# EAGLE design gpioextender (EAGLE 9.6.2)
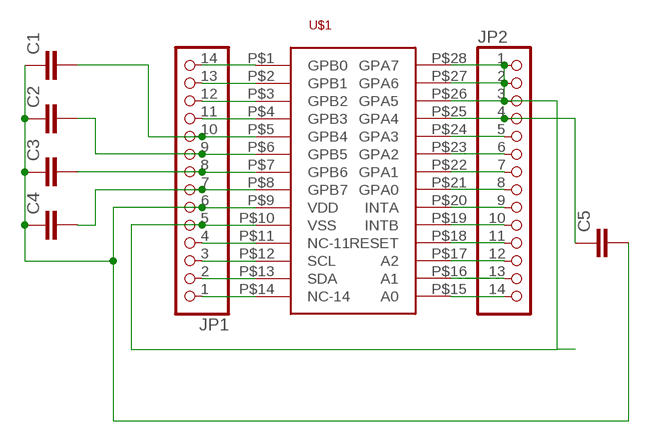
[diagram p0: schematic, sheet 1]

## Parts
C1  C-EU050-025X075  [C050-025X075]
C2  C-EU050-025X075  [C050-025X075]
C3  C-EU050-025X075  [C050-025X075]
C4  C-EU050-025X075  [C050-025X075]
C5  C-EU050-025X075  [C050-025X075]
JP1  PINHD-1X14  [1X14]
JP2  PINHD-1X14  [1X14]
U$1  MCP23017-E/SP  [DIP28]

## Nets
N$1: C1.2 C4.2 JP1.7 JP1.10 U$1.P$5(GPB4) U$1.P$8(GPB7)
N$2: JP1.1 U$1.P$14(NC-14)
N$3: JP1.2 U$1.P$13(SDA)
N$4: JP1.3 U$1.P$12(SCL)
N$5: JP1.4 U$1.P$11(NC-11)
N$6: JP2.12 U$1.P$17(A2)
N$7: JP2.13 U$1.P$16(A1)
N$8: C3.2 JP1.8 U$1.P$7(GPB6)
N$9: C2.2 JP1.9 U$1.P$6(GPB5)
N$10: JP1.11 U$1.P$4(GPB3)
N$11: JP1.12 U$1.P$3(GPB2)
N$12: JP1.13 U$1.P$2(GPB1)
N$13: JP1.14 U$1.P$1(GPB0)
N$14: JP2.14 U$1.P$15(A0)
N$15: C1.1 C2.1 C3.1 C4.1 C5.2 JP1.6 U$1.P$9(VDD)
N$16: JP1.5 JP2.1 JP2.2 JP2.3 U$1.P$10(VSS) U$1.P$26(GPA5) U$1.P$27(GPA6) U$1.P$28(GPA7)
N$17: JP2.11 U$1.P$18(RESET)
N$18: JP2.10 U$1.P$19(INTB)
N$19: JP2.9 U$1.P$20(INTA)
N$20: JP2.8 U$1.P$21(GPA0)
N$21: JP2.7 U$1.P$22(GPA1)
N$22: JP2.6 U$1.P$23(GPA2)
N$23: JP2.5 U$1.P$24(GPA3)
N$24: C5.1 JP2.4 U$1.P$25(GPA4)

## Library data of the parts
C1-C5 = resistor:C-EU: CAPACITOR, European symbol
JP1 JP2 = pinhead:PINHD-1X14: PIN HEADER
U$1 = IO-Expanders:MCP23017-E/SP: MCP23017 16 pin IO Expander using I2C bus; MCP23017-ESP: DIP

## Board
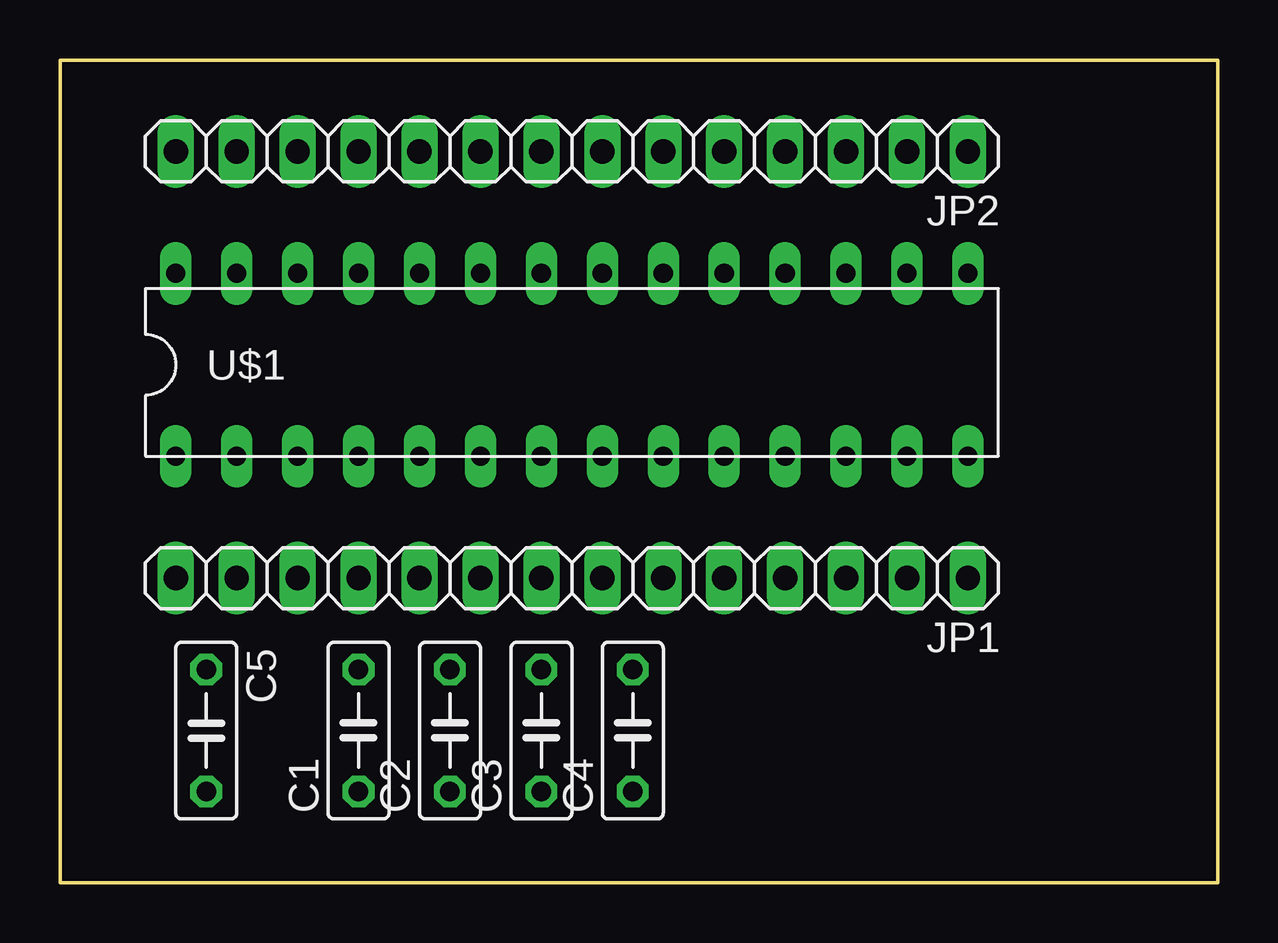
[diagram p1: board, top side]
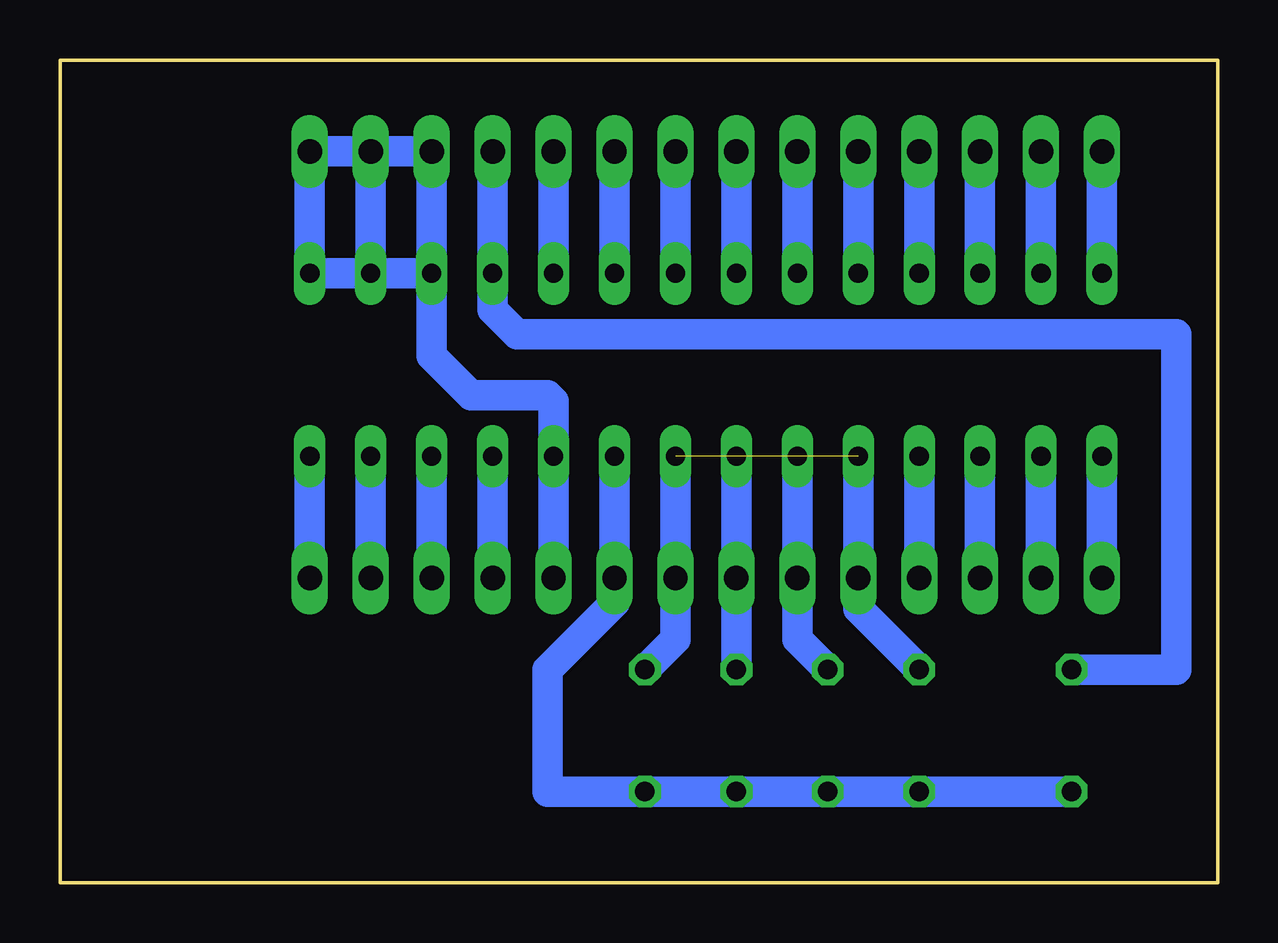
[diagram p2: board, bottom side, seen from below]

Size 48.26 x 34.29 mm. Coordinates in mm from the lower left corner, seen from the top.
Outline: 0,0 48.26,0 48.26,34.29 0,34.29 0,0
Copper layers (1*16): Top 0.035mm / dielectric 1.5mm / Bottom 0.035mm
Design rules "default": minimum track width 6mil, minimum drill 0.35mm, track to track 6mil, track to pad 6mil, pad to pad 6mil, via to via 6mil, smd to smd 6mil, copper to edge 40mil, drill to drill 6mil, minimum pad ring 10mil, minimum via ring 8mil, stop-mask expansion 4mil, vias tented up to drill 0mil, thermal gap 10mil

### Footprints (pad centres in the part's own frame; a part is rotated, then mirrored left to right if it is on the bottom)
C050-025X075 = drill 0.813 octagon: 1 -2.54,0; 2 2.54,0
1X14 = drill 1.016 long: 1 -16.51,0; 2 -13.97,0; 3 -11.43,0; 4 -8.89,0; 5 -6.35,0; 6 -3.81,0; 7 -1.27,0; 8 1.27,0; 9 3.81,0; 10 6.35,0; 11 8.89,0; 12 11.43,0; 13 13.97,0; 14 16.51,0
DIP28 = drill 0.8 long: P$1 0,0; P$2 2.54,0; P$3 5.08,0; P$4 7.62,0; P$5 10.16,0; P$6 12.7,0; P$7 15.24,0; P$8 17.78,0; P$9 20.32,0; P$10 22.86,0; P$11 25.4,0; P$12 27.94,0; P$13 30.48,0; P$14 33.02,0; P$15 0,7.62; P$16 2.54,7.62; P$17 5.08,7.62; P$18 7.62,7.62; P$19 10.16,7.62; P$20 12.7,7.62; P$21 15.24,7.62; P$22 17.78,7.62; P$23 20.32,7.62; P$24 22.86,7.62; P$25 25.4,7.62; P$26 27.94,7.62; P$27 30.48,7.62; P$28 33.02,7.62

### Placement (x,y rotation side)
C1  12.45,6.35 90 top
C2  16.26,6.35 90 top
C3  20.07,6.35 90 top
C4  23.88,6.35 90 top
C5  6.1,6.35 270 top
JP1  21.34,12.7 180 top
JP2  21.34,30.48 180 top
U$1  4.83,17.78 0 top

### Tracks (layer width: path | path; a pad name or v marks a point on that pad's centre or on a via)
N$1  (1 unrouted)
  Bottom 1.27: U$1.P$5 JP1.10 14.99,11.43 C1.2 | C4.2 22.61,10.16 JP1.7 U$1.P$8
N$2
  Bottom 1.27: JP1.1 U$1.P$14
N$3
  Bottom 1.27: U$1.P$13 JP1.2
N$4
  Bottom 1.27: JP1.3 U$1.P$12
N$5
  Bottom 1.27: JP1.4 U$1.P$11
N$6
  Bottom 1.27: U$1.P$17 JP2.12
N$7
  Bottom 1.27: U$1.P$16 JP2.13
N$8
  Bottom 1.27: U$1.P$7 JP1.8 C3.2
N$9
  Bottom 1.27: C2.2 17.53,10.16 JP1.9 U$1.P$6
N$10
  Bottom 1.27: U$1.P$4 JP1.11
N$11
  Bottom 1.27: U$1.P$3 JP1.12
N$12
  Bottom 1.27: JP1.13 U$1.P$2
N$13
  Bottom 1.27: JP1.14 U$1.P$1
N$14
  Bottom 1.27: U$1.P$15 JP2.14
N$15
  Bottom 1.27: C5.2 C1.1 C2.1 C3.1 C4.1 27.94,3.81 27.94,8.89 25.15,11.68 JP1.6 U$1.P$9
N$16
  Bottom 1.27: JP1.5 U$1.P$10 27.69,20.07 27.94,20.32 31.11,20.32 32.77,21.97 U$1.P$26 | U$1.P$27 JP2.2 | JP2.2 JP2.1 U$1.P$28 U$1.P$27 | JP2.2 JP2.3 U$1.P$26 | U$1.P$26 U$1.P$27
N$17
  Bottom 1.27: U$1.P$18 JP2.11
N$18
  Bottom 1.27: U$1.P$19 JP2.10
N$19
  Bottom 1.27: U$1.P$20 JP2.9
N$20
  Bottom 1.27: U$1.P$21 JP2.8
N$21
  Bottom 1.27: U$1.P$22 JP2.7
N$22
  Bottom 1.27: U$1.P$23 JP2.6
N$23
  Bottom 1.27: U$1.P$24 JP2.5
N$24
  Bottom 1.27: C5.1 1.73,8.89 1.73,22.86 29.21,22.86 30.23,23.88 U$1.P$25 JP2.4